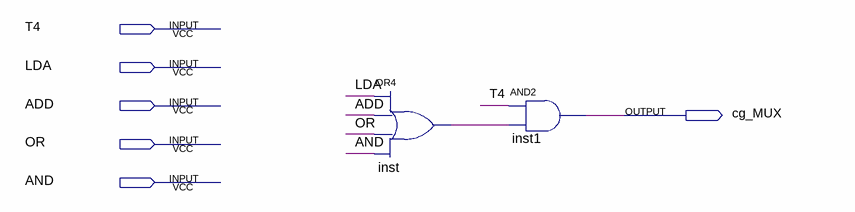
[diagram p0: schematic sheet]
// Quartus schematic abk_carga_mux.bdf as structural Verilog: 2 symbols, 6 pins
module abk_carga_mux (
  input  T4,
  input  LDA,
  input  ADD,
  input  OR,
  input  AND,
  output cg_MUX
);

  wire inst_out;

  or inst (inst_out, LDA, ADD, OR, AND);
  and inst1 (cg_MUX, T4, inst_out);
endmodule
